# EAGLE design Contatore a relay 2bit - Product (EAGLE 9.6.2)
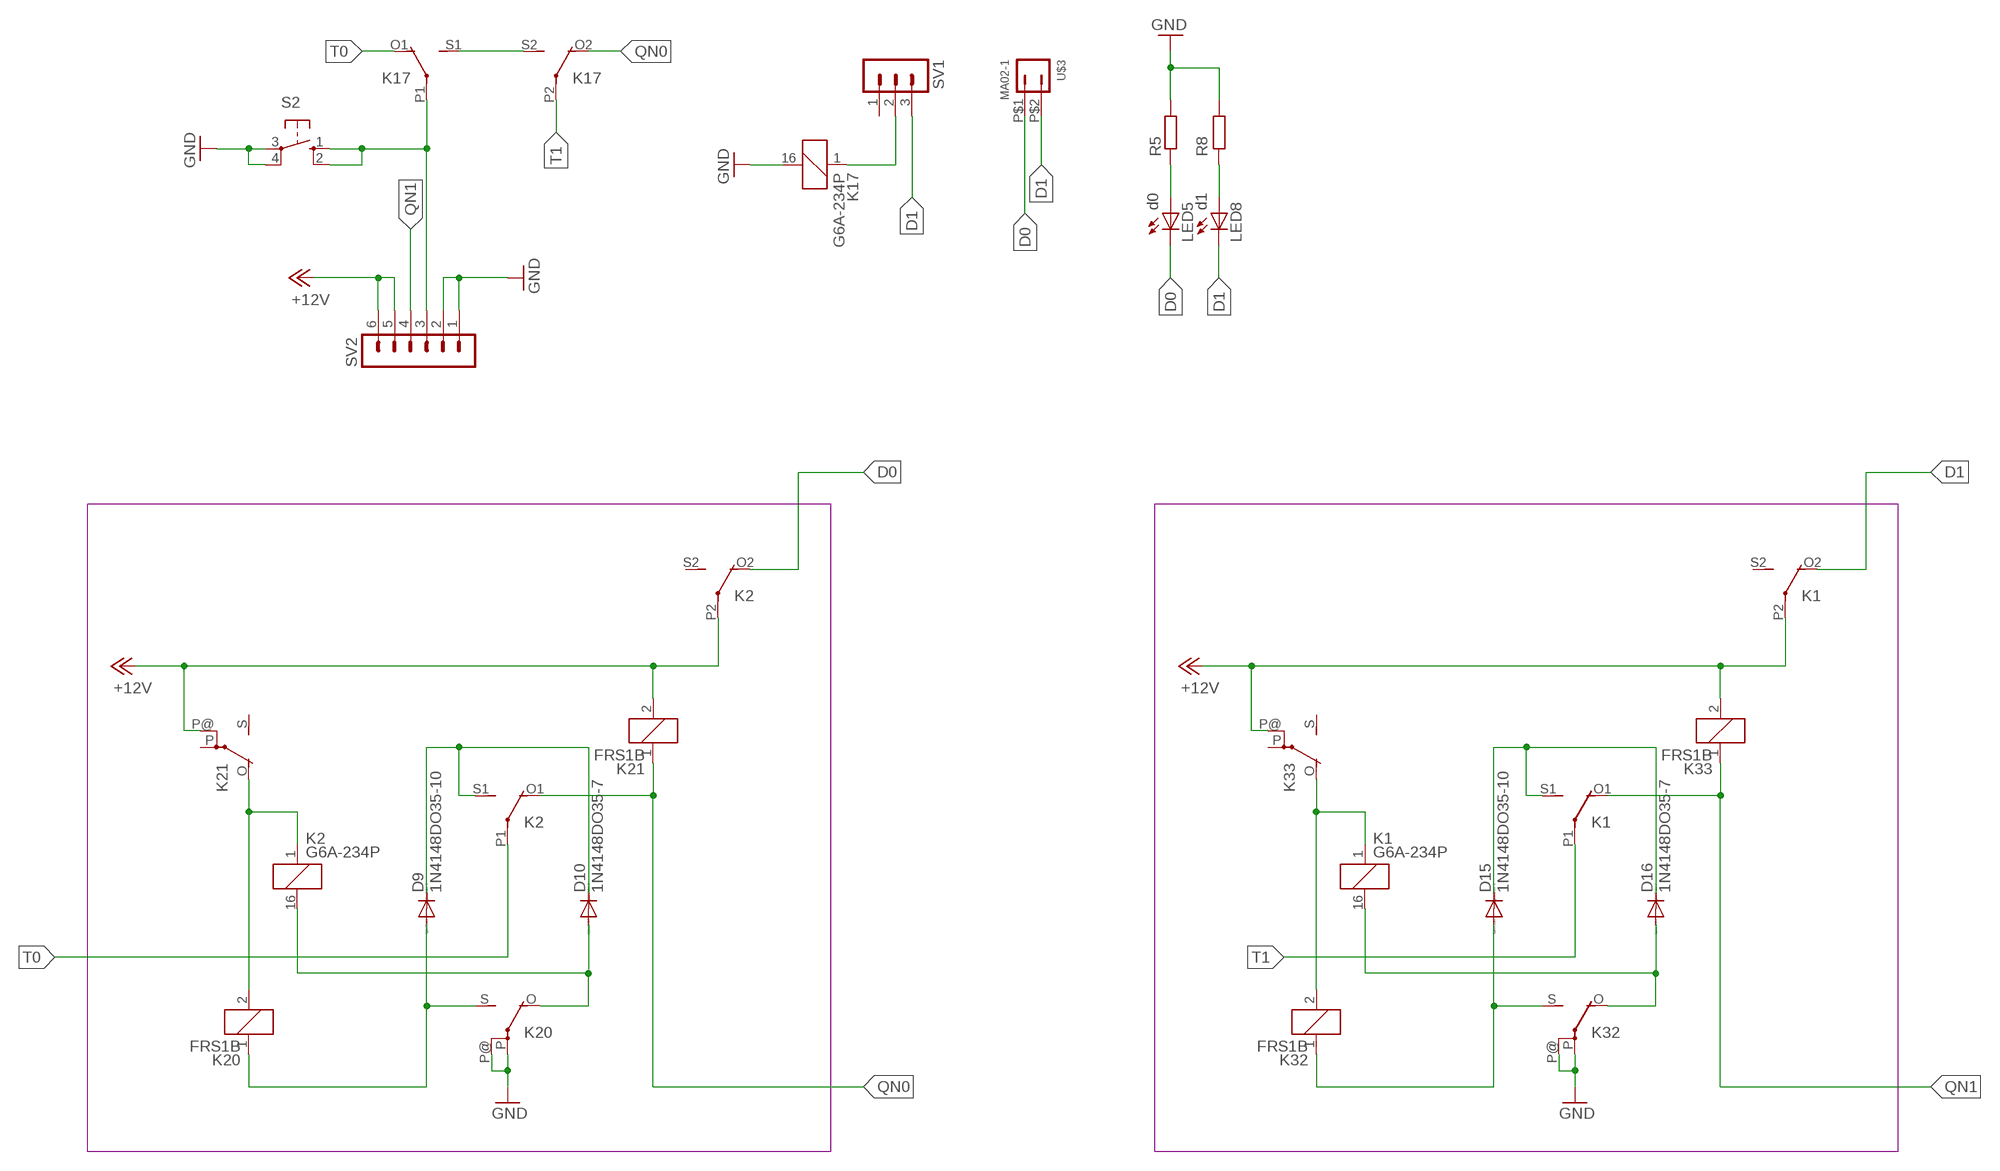
[diagram p0: schematic, sheet 1]

## Parts
D9  1N4148DO35-10  [DO35-10]
D10  1N4148DO35-7  [DO35-7]
D15  1N4148DO35-10  [DO35-10]
D16  1N4148DO35-7  [DO35-7]
K1  G6A-234P  [G6A-234P]
K2  G6A-234P  [G6A-234P]
K17  G6A-234P  [G6A-234P]
K20  FRS1B  [FRS1B]
K21  FRS1B  [FRS1B]
K32  FRS1B  [FRS1B]
K33  FRS1B  [FRS1B]
LED5  d0  LED3MM  [LED3MM]
LED8  d1  LED3MM  [LED3MM]
R5  R-EU_M0805  [M0805]
R8  R-EU_M0805  [M0805]
S2  10-XX  [B3F-10XX]
SV1  MA03-1  [MA03-1]
SV2  MA06-1  [MA06-1]
U$3  MA02-1  [MA02-1]

## Nets
+12V: K1.P2(3:P) K2.P2(3:P) K21.2 K21.P@(2:P) K33.2 K33.P@(2:P) SV2.5 SV2.6
D0: K2.O2(3:O) LED5.K(C) U$3.P$1
D1: K1.O2(3:O) LED8.K(C) SV1.3 U$3.P$2
GND: K17.16 K20.P(2:P) K20.P@(2:P) K32.P(2:P) K32.P@(2:P) R5.2 R8.2 S2.3(P) S2.4(P1) SV2.1 SV2.2
N$1: K17.1 SV1.2
N$20: K17.P1(2:P) S2.1(S) S2.2(S1) SV2.3
N$35: D10.A K2.16 K20.O(2:O)
N$36: D9.A K20.1 K20.S(2:S)
N$37: K2.1 K20.2 K21.O(2:O)
N$40: D9.C D10.C K2.S1(2:S)
N$55: D16.A K1.16 K32.O(2:O)
N$56: D15.A K32.1 K32.S(2:S)
N$57: K1.1 K32.2 K33.O(2:O)
N$58: D15.C D16.C K1.S1(2:S)
N$60: K17.S1(2:S) K17.S2(3:S)
N$64: LED5.A R5.1
N$67: LED8.A R8.1
QN0: K2.O1(2:O) K17.O2(3:O) K21.1
QN1: K1.O1(2:O) K33.1 SV2.4
T0: K2.P1(2:P) K17.O1(2:O)
T1: K1.P1(2:P) K17.P2(3:P)
Unconnected: K1.S2(3:S) K2.S2(3:S) K21.P(2:P) K21.S(2:S) K33.P(2:P) K33.S(2:S) SV1.1

## Library data of the parts
D9 D10 D15 D16 = diode:1N4148: DIODE high speed (Philips)
K1 K2 K17 = relay:G6A-234P: RELAY 2 x switch, 0.3 A/125 V AC, 1 A/30 V DC, Omron; OC_FARNELL: unknown; OC_NEWARK: unknown
K20 K21 K32 K33 = relay:FRS1B: RELAY 1 x switch, same as V23101-D6-A201, Siemens; OC_FARNELL: unknown; OC_NEWARK: unknown
LED5 LED8 = led:LED: LED OSRAM: - CHIPLED LG R971, LG N971, LY N971, LG Q971, LY Q971, LO R971, LY R971 LH N974, LH R974 LS Q976, LO Q976, LY Q976 LO Q996 - Hyper CHIPLED LW Q18S LB Q993, LB Q99A, LB R99A - SideLED LS A670, LO A670, LY A670, LG A670, LP A670 LB A673, LV A673, LT A673, LW A673 LH A674 LY A675 LS A676, LA A676, LO A676, LY A676, LW A676 LS A679, LY A679, LG A679 - Hyper Micro SIDELED® LS Y876, LA Y876, LO Y876, LY Y876 LT Y87S - SmartLED LW L88C, LW L88S LB L89C, LB L89S, LG L890 LS L89K, LO L89K, LY L89K LS L896, LA L896, LO L896, LY L896 - TOPLED LS T670, LO T670, LY T670, LG T670, LP T670 LSG T670, LSP T670, LSY T670, LOP T670, LYG T670 LG T671, LOG T671, LSG T671 LB T673, LV T673, LT T673, LW T673 LH T674 LS T676, LA T676, LO T676, LY T676, LB T676, LH T676, LSB T676, LW T676 LB T67C, LV T67C, LT T67C, LS T67K, LO T67K, LY T67K, LW E67C LS E67B, LA E67B, LO E67B, LY E67B, LB E67C, LV E67C, LT E67C LW T67C LS T679, LY T679, LG T679 LS T770, LO T770, LY T770, LG T770, LP T770 LB T773, LV T773, LT T773, LW T773 LH T774 LS E675, LA E675, LY E675, LS T675 LS T776, LA T776, LO T776, LY T776, LB T776 LHGB T686 LT T68C, LB T68C - Hyper Mini TOPLED® LB M676 - Mini TOPLED Santana® LG M470 LS M47K, LO M47K, LY M47K Source: http://www.osram.convergy.de LUXEON: - LUMILED® LXK2-PW12-R00, LXK2-PW12-S00, LXK2-PW14-U00, LXK2-PW14-V00 LXK2-PM12-R00, LXK2-PM12-S00, LXK2-PM14-U00 LXK2-PE12-Q00, LXK2-PE12-R00, LXK2-PE12-S00, LXK2-PE14-T00, LXK2-PE14-U00 LXK2-PB12-K00, LXK2-PB12-L00, LXK2-PB12-M00, LXK2-PB14-N00, LXK2-PB14-P00, LXK2-PB14-Q00 LXK2-PR12-L00, LXK2-PR12-M00, LXK2-PR14-Q00, LXK2-PR14-R00 LXK2-PD12-Q00, LXK2-PD12-R00, LXK2-PD12-S00 LXK2-PH12-R00, LXK2-PH12-S00 LXK2-PL12-P00, LXK2-PL12-Q00, LXK2-PL12-R00 Source: www.luxeon.com KINGBRIGHT: KA-3528ASYC Source: www.kingbright.com
R5 R8 = rcl:R-EU_: RESISTOR, European symbol
S2 = switch-omron:10-XX: OMRON SWITCH; MPN: B3F-1000; OC_FARNELL: 176432; OC_NEWARK: 36M3542
SV1 = con-lstb:MA03-1: PIN HEADER; OC_FARNELL: unknown; OC_NEWARK: unknown
SV2 = con-lstb:MA06-1: PIN HEADER; OC_FARNELL: unknown; OC_NEWARK: unknown
U$3 = con-lstb:MA02-1

## Board
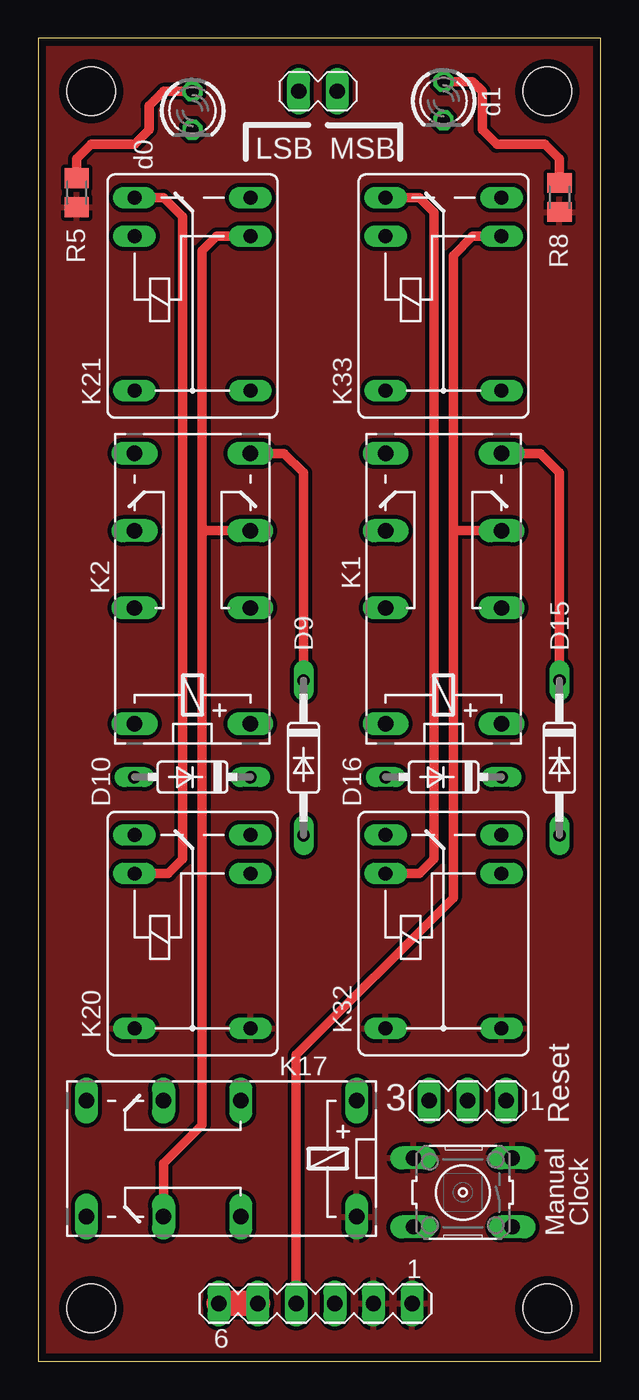
[diagram p1: board, top side]
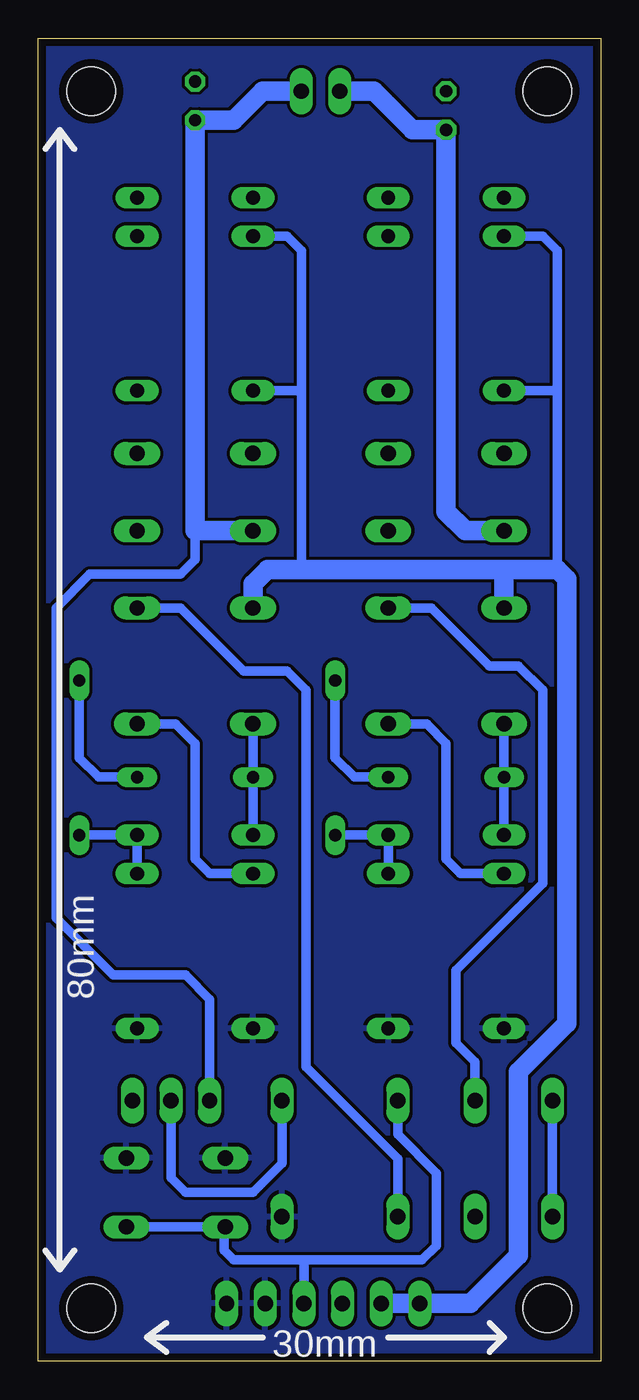
[diagram p2: board, bottom side, seen from below]

Size 37 x 87 mm. Coordinates in mm from the lower left corner, seen from the top.
Outline: 0,0 37,0 37,87 0,87 0,0
Copper layers (1*16): Top 0.035mm / dielectric 1.5mm / Bottom 0.035mm
Design rules "default *": minimum track width 10mil, minimum drill 24mil, track to track 8mil, track to pad 8mil, pad to pad 8mil, via to via 8mil, smd to smd 8mil, copper to edge 20mil, drill to drill 8mil, minimum pad ring 10mil, minimum via ring 8mil, stop-mask expansion 4mil, vias tented up to drill 0mil, thermal gap 10mil
Holes 3.2 mm at 3.5,83.5 33.5,83.5 33.5,3.5 3.5,3.5

### Footprints (pad centres in the part's own frame; a part is rotated, then mirrored left to right if it is on the bottom)
DO35-10 = drill 0.813 long: A 5.08,0; C -5.08,0
DO35-7 = drill 0.813 long: A 3.81,0; C -3.81,0
G6A-234P = drill 1.016 long: 1 -3.81,-3.81; 16 -3.81,3.81; O1 8.89,-3.81; O2 8.89,3.81; P1 3.81,-3.81; P2 3.81,3.81; S1 13.97,-3.81; S2 13.97,3.81
FRS1B = drill 0.914 long: 1 0,3.81; 2 0,-3.81; O -2.54,-3.81; P 10.16,3.81; P@ 10.16,-3.81; S -2.54,3.81
LED3MM = drill 0.813 octagon: A -1.27,0; K 1.27,0
M0805 = smd 1.3 x 1.6: 1 -0.95,0; 2 0.95,0
B3F-10XX = drill 1.016 long: 1 -3.251,2.261; 2 3.251,2.261; 3 -3.251,-2.261; 4 3.251,-2.261
MA03-1 = drill 1.016 long: 1 -2.54,0; 2 0,0; 3 2.54,0
MA06-1 = drill 1.016 long: 1 -6.35,0; 2 -3.81,0; 3 -1.27,0; 4 1.27,0; 5 3.81,0; 6 6.35,0
MA02-1 = drill 1.016 long: P$1 -1.27,0; P$2 1.27,0

### Placement (x,y rotation side)
D9  17.46,39.69 270 top
D10  10.16,38.42 180 top
D15  34.29,39.69 270 top
D16  26.67,38.42 180 top
K1  26.67,45.72 90 top
K2  10.16,45.72 90 top
K17  17.14,13.34 180 top
K20  10.16,32.07 270 top
K21  10.16,73.98 270 top
K32  26.67,32.07 270 top
K33  26.67,73.98 270 top
LED5  10.16,82.23 270 top
LED8  26.67,82.87 270 top
R5  2.54,76.83 270 top
R8  34.29,76.52 270 top
S2  27.94,11.11 180 top
SV1  28.26,17.14 180 top
SV2  18.25,3.81 180 top
U$3  18.41,83.5 0 top

### Tracks (layer width: path | path; a pad name or v marks a point on that pad's centre or on a via)
+12V
  Top 1.676: SV2.5 SV2.6
  Bottom 0.61: K33.2 20.64,73.98 19.68,73.03 19.68,63.82 | 19.68,63.82 19.68,52.07 | K33.P@ 19.68,63.82 | K21.2 3.81,73.98 2.86,73.03 2.86,63.82 | 2.86,63.82 2.86,52.07 | K21.P@ 2.86,63.82
  Bottom 1.27: K1.P2 22.86,51.12 21.91,52.07 19.68,52.07 6.35,52.07 | 6.35,52.07 2.86,52.07 2.22,51.44 2.22,22.23 5.4,19.05 5.4,6.99 8.57,3.81 SV2.5 | K2.P2 6.35,52.07
D0
  Bottom 1.27: K2.O2 8.89,54.61 10.16,55.88 LED5.K 12.38,80.96 14.92,83.5 U$3.P$1
D1
  Bottom 0.61: SV1.3 25.72,23.81 27.3,25.4 32.07,25.4 35.81,29.15 35.81,49.53 33.59,51.75 27.62,51.75 26.67,52.7 26.67,54.61
  Bottom 1.27: K1.O2 26.67,54.61 LED8.K 24.13,81.6 22.23,83.5 U$3.P$2
GND
  pour Bottom: 39,-2 -2,-2 -2,89 39,89
  pour Top (isolate 0.254): 41,-4 -4,-4 -4,91 41,91
N$1
  Bottom 0.61: K17.1 20.95,13.02 22.86,11.11 27.3,11.11 28.26,12.06 SV1.2
N$20
  Bottom 0.61: SV2.3 19.52,6.67 | K17.P1 13.34,14.92 10.79,12.38 10.79,7.62 11.75,6.67 19.52,6.67 | 19.52,6.67 24.13,6.67 24.77,7.3 24.77,8.78 S2.2 S2.1
N$35
  Bottom 0.61: K20.O D10.A K2.16
N$36
  Bottom 0.61: K20.1 K20.S D9.A
N$37
  Top 0.61: K21.O 8.26,76.52 9.53,75.25 9.53,33.02 8.57,32.07 K20.2
  Bottom 0.61: K20.2 9.21,32.07 10.16,33.02 10.16,40.64 11.43,41.91 K2.1
N$40
  Top 0.61: K2.S1 16.19,59.69 17.46,58.42 D9.C
  Bottom 0.61: D10.C 16.19,38.42 17.46,39.69 D9.C
N$55
  Bottom 0.61: K32.O D16.A K1.16
N$56
  Bottom 0.61: K32.1 K32.S D15.A
N$57
  Top 0.61: K32.2 25.08,32.07 26.04,33.02 26.04,75.56 25.08,76.52 K33.O
  Bottom 0.61: K32.2 25.72,32.07 26.67,33.02 26.67,40.64 27.94,41.91 K1.1
N$58
  Top 0.61: K1.S1 33.02,59.69 34.29,58.42 D15.C
  Bottom 0.61: D16.C 33.02,38.42 34.29,39.69 D15.C
N$60
  Bottom 0.61: K17.S2 K17.S1
N$64
  Top 0.61: LED5.A 8.26,83.5 7.3,82.55 7.3,80.96 6.35,80.01 3.49,80.01 2.54,79.06 R5.1
N$67
  Top 0.61: R8.1 34.29,79.06 33.34,80.01 30.16,80.01 29.21,80.96 29.21,83.5 28.57,84.14 LED8.A
QN0
  Top 0.61: K21.1 11.75,73.98 10.79,73.03 10.79,54.61 | 10.79,54.61 K2.O1 | 10.79,54.61 10.79,15.56 8.26,13.02 K17.O2
QN1
  Top 0.61: K33.1 28.57,73.98 27.3,72.71 27.3,54.61 | K1.O1 27.3,54.61 | 27.3,54.61 27.3,30.48 16.98,20.16 SV2.4
T0
  Bottom 0.61: K2.P1 11.11,49.53 7.3,45.72 5.4,45.72 3.81,44.13 3.81,31.43 9.53,25.72 9.53,20.95 8.26,19.68 K17.O1
T1
  Bottom 0.61: K1.P1 27.62,49.53 23.5,45.4 20.64,45.4 19.37,44.13 19.37,19.37 13.34,13.34 K17.P2

### Text on the board
tPlace: 3
tNames: LSB | MSB | Reset | Clock | Manual
bNames: 80mm | 30mm